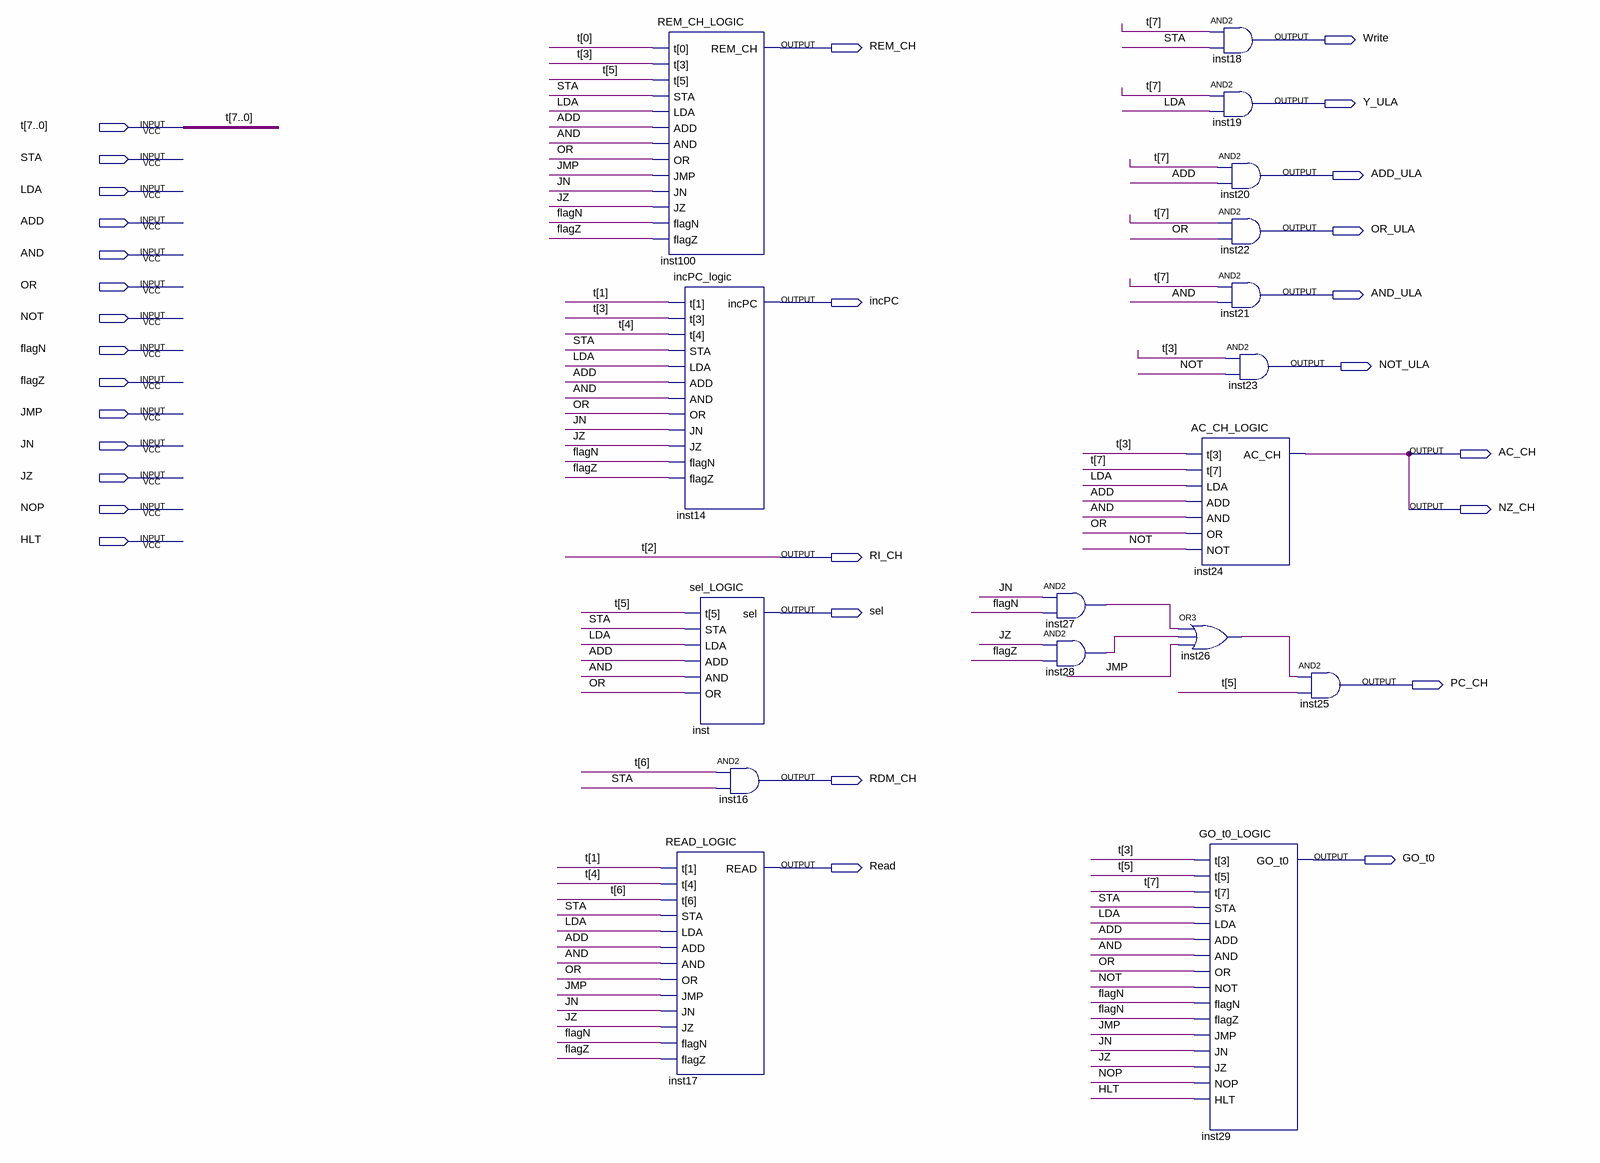
[diagram p0: schematic sheet]
// Quartus schematic UC.bdf as structural Verilog: 17 symbols, 30 pins
module UC (
  input  [7:0] t,
  input  STA,
  input  LDA,
  input  ADD,
  input  AND,
  input  OR,
  input  NOT,
  input  flagN,
  input  flagZ,
  input  JMP,
  input  JN,
  input  JZ,
  input  NOP,
  input  HLT,
  output Write,
  output REM_CH,
  output Y_ULA,
  output ADD_ULA,
  output OR_ULA,
  output AND_ULA,
  output incPC,
  output NOT_ULA,
  output AC_CH,
  output NZ_CH,
  output RI_CH,
  output sel,
  output PC_CH,
  output RDM_CH,
  output GO_t0,
  output Read
);

  wire inst26_out, inst27_out, inst28_out;

  REM_CH_LOGIC inst100 (
    .t({t[5], t[3], t[0]}), .STA(STA), .LDA(LDA), .ADD(ADD), .AND(AND), .OR(OR), .JMP(JMP), .JN(JN), .JZ(JZ),
    .flagN(flagN), .flagZ(flagZ), .REM_CH(REM_CH));
  incPC_logic inst14 (
    .t({t[4:3], t[1]}), .STA(STA), .LDA(LDA), .ADD(ADD), .AND(AND), .OR(OR), .JN(JN), .JZ(JZ), .flagN(flagN),
    .flagZ(flagZ), .incPC(incPC));
  sel_LOGIC inst (.t(t[5]), .STA(STA), .LDA(LDA), .ADD(ADD), .AND(AND), .OR(OR), .sel(sel));
  READ_LOGIC inst17 (
    .t({t[6], t[4], t[1]}), .STA(STA), .LDA(LDA), .ADD(ADD), .AND(AND), .OR(OR), .JMP(JMP), .JN(JN), .JZ(JZ),
    .flagN(flagN), .flagZ(flagZ), .READ(Read));
  and inst16 (RDM_CH, t[6], STA);
  and inst27 (inst27_out, JN, flagN);
  and inst28 (inst28_out, JZ, flagZ);
  AC_CH_LOGIC inst24 (.t({t[7], t[3]}), .LDA(LDA), .ADD(ADD), .AND(AND), .OR(OR), .NOT(NOT), .AC_CH(AC_CH));
  or inst26 (inst26_out, inst27_out, inst28_out, JMP);
  GO_t0_LOGIC inst29 (
    .t({t[7], t[5], t[3]}), .STA(STA), .LDA(LDA), .ADD(ADD), .AND(AND), .OR(OR), .NOT(NOT), .flagN(flagN),
    .flagZ(flagN), .JMP(JMP), .JN(JN), .JZ(JZ), .NOP(NOP), .HLT(HLT), .GO_t0(GO_t0));
  and inst18 (Write, t[7], STA);
  and inst19 (Y_ULA, t[7], LDA);
  and inst20 (ADD_ULA, t[7], ADD);
  and inst22 (OR_ULA, t[7], OR);
  and inst21 (AND_ULA, t[7], AND);
  and inst23 (NOT_ULA, t[3], NOT);
  and inst25 (PC_CH, inst26_out, t[5]);

  assign NZ_CH = AC_CH;
  assign RI_CH = t[2];
endmodule
